# EAGLE design ATTEN_v2 (EAGLE 7.1.0)
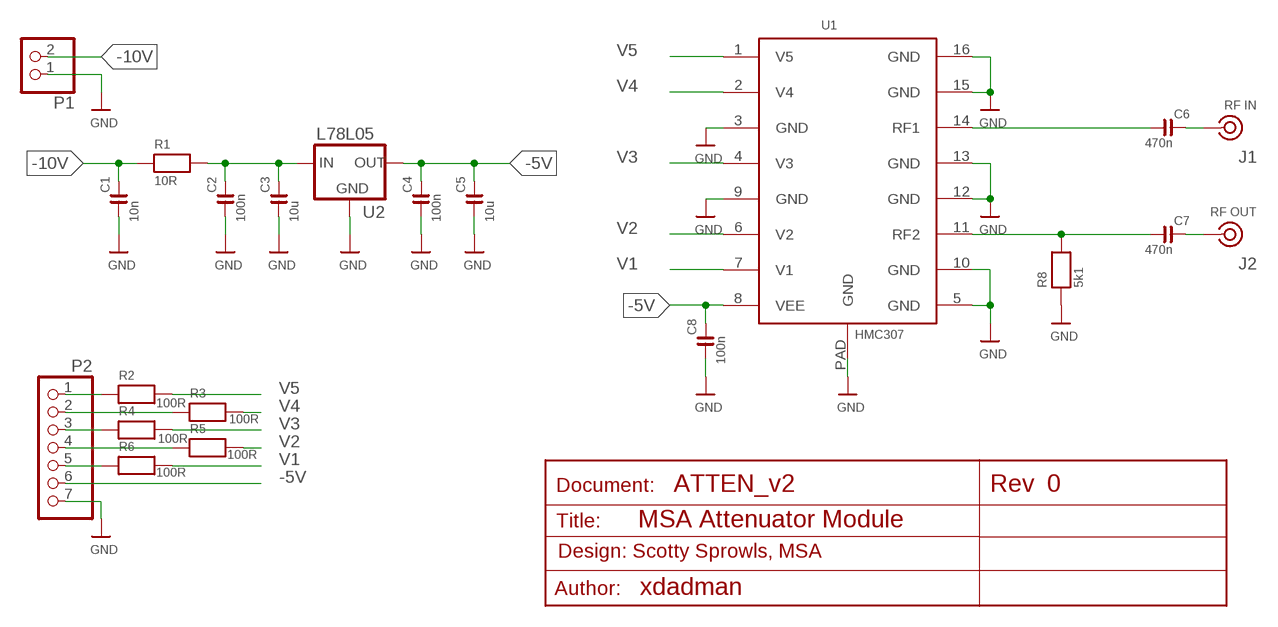
[diagram p0: schematic, sheet 1]

## Parts
C1  10n  C080510N  [C0805]
C2  100n  C0805100N  [C0805]
C3  10u  CC120610U  [1206]
C4  100n  C0805100N  [C0805]
C5  10u  CC120610U  [1206]
C6  470n  C0805470N  [C0805]
C7  470n  C0805470N  [C0805]
C8  100n  C0805100N  [C0805]
J1  RF IN  COAX  [SLIM_COAX_PAD]
J2  RF OUT  COAX  [SLIM_COAX_PAD]
P1  PINHD-1X2  [1X02]
P2  PINHD-1X7  [1X07]
R1  10R  R080510R  [R0805]
R2  100R  R0402100R  [R0402]
R3  100R  R0402100R  [R0402]
R4  100R  R0402100R  [R0402]
R5  100R  R0402100R  [R0402]
R6  100R  R0402100R  [R0402]
R8  5k1  R04025K1  [R0402]
U1  HMC307  [QSOP16_PAD]
U2  L78L05  [SOT89]

## Nets
-5V: C4.2 C5.2 C8.2 P2.6 U1.8(VEE) U2.3(OUT)
-10V: C1.2 P1.2 R1.1
GND: C1.1 C2.1 C3.1 C4.1 C5.1 C8.1 P1.1 P2.7 R8.1 U1.3(GND) U1.5(GND) U1.9(GND) U1.10(GND) U1.12(GND) U1.13(GND) U1.15(GND) U1.16(GND) U1.PAD(GND) U2.1(GND)
INV1: P2.5 R6.1
INV2: P2.4 R5.1
INV3: P2.3 R4.1
INV4: P2.2 R3.1
INV5: P2.1 R2.1
N$1: C2.2 C3.2 R1.2 U2.2(IN) U2.4(IN)
N$2 [50ohm_atten]: C6.2 J1.SIG
N$3 [50ohm_atten]: C7.2 J2.SIG
N$8 [50ohm_atten]: C7.1 R8.2 U1.11(RF2)
N$9 [50ohm_atten]: C6.1 U1.14(RF1)
V1: R6.2 U1.7(V1)
V2: R5.2 U1.6(V2)
V3: R4.2 U1.4(V3)
V4: R3.2 U1.2(V4)
V5: R2.2 U1.1(V5)

## Notes on the sheet
- 0
- MSA Attenuator Module
- Design: Scotty Sprowls, MSA
- xdadman

## Power pins joined to a net without a drawn wire
GND: J1.GND J2.GND

## Library data of the parts
C1 = MSA_lib:C0805: Ceramic capacitor; OC_FARNELL: 1414662
C2 C4 C8 = MSA_lib:C0805: Ceramic capacitor; OC_FARNELL: 1759166
C3 C5 = MSA_lib:CC1206: Capacitor ceramic 1206; OC_FARNELL: 1611967
C6 C7 = MSA_lib:C0805: Ceramic capacitor; OC_FARNELL: 1828926
J1 J2 = MSA_lib:COAX
P1 = MSA_lib:PINHD-1X2: PIN HEADER
P2 = MSA_lib:PINHD-1X7: PIN HEADER
R1 = MSA_lib:R0805: Resistors; OC_FARNELL: 2332043
R2-R6 = MSA_lib:R0402: R0402 resistor; OC_FARNELL: 2331443
R8 = MSA_lib:R0402: R0402 resistor; OC_FARNELL: 2331547
U1 = MSA_lib:HMC307: HMC307 Attenuator; OC_DIGIKEY: 1127-1327-1-ND
U2 = MSA_lib:L78L05: 7805 -5V LDO from STM; OC_FARNELL: 1366573

## Net classes
1 50ohm_atten: clearance 0.26 mm

## Board

Size 32 x 32 mm. Coordinates in mm from the lower left corner, seen from the top.
Outline: 0,0 32,0 32,32 0,32 0,0
Copper layers (1*16): Top 0.035mm / dielectric 1.5mm / Bottom 0.035mm
Design rules "kuba_no_CLR": minimum track width 8mil, minimum drill 15mil, track to track 8mil, track to pad 8mil, pad to pad 8mil, via to via 8mil, smd to smd 8mil, copper to edge 0mil, drill to drill 8mil, minimum pad ring 12mil, minimum via ring 10mil, stop-mask expansion 4mil, vias tented up to drill 0mil, thermal gap 10mil

### Footprints (pad centres in the part's own frame; a part is rotated, then mirrored left to right if it is on the bottom)
C0805 = smd 1.2 x 1.5: 1 -0.953,0; 2 0.953,0
1206 = smd 1.6 x 1.8: 1 -1.4,0; 2 1.4,0
SLIM_COAX_PAD = smd 1.27 x 0.635 bottom: GND 0,-2.667 | drill 1.1: SIG 0,0
1X02 = drill 1.016: 1 -1.27,0; 2 1.27,0
1X07 = drill 1.016: 1 -7.62,0; 2 -5.08,0; 3 -2.54,0; 4 0,0; 5 2.54,0; 6 5.08,0; 7 7.62,0
R0805 = smd 1.3 x 1.5: 1 -0.95,0; 2 0.95,0
R0402 = smd 0.6 x 0.6: 1 -0.5,0; 2 0.5,0
QSOP16_PAD = smd 1.6 x 0.356: 1 -2.667,2.235; 2 -2.667,1.575; 3 -2.667,0.965; 4 -2.667,0.305; 5 -2.667,-0.305; 6 -2.667,-0.965; 7 -2.667,-1.575; 8 -2.667,-2.235; 9 2.667,-2.235; 10 2.667,-1.6; 11 2.667,-0.965; 12 2.667,-0.305; 13 2.667,0.305; 14 2.667,0.965; 15 2.667,1.6; 16 2.667,2.235 | smd 1.8 x 2.4: PAD 0,0
SOT89 = smd 1.2 x 1.5: 1 -1.6,-2; 3 1.6,-2 | smd 1 x 1.5: 2 0,-2 | smd 2.4 x 3: 4 0,1.25

### Placement (x,y rotation side)
C1  7.4,4.32 90 top
C2  13.46,4.32 90 top
C3  11.43,5.08 90 top
C4  20.57,4.32 90 top
C5  22.1,7.37 180 top
C6  9.14,24.13 180 top
C7  22.86,24.13 0 top
C8  19.81,14.73 90 top
J1  7.11,24.13 270 top
J2  24.89,24.13 90 top
P1  4.79,5.32 90 top
P2  12.45,10.16 0 top
R1  8.38,7.11 0 top
R2  4.83,12.45 90 top
R3  7.37,12.45 90 top
R4  9.91,12.45 90 top
R5  12.45,12.45 90 top
R6  14.99,12.45 90 top
R8  20.83,23.37 90 top
U1  16.26,18.54 90 top
U2  16.51,6.1 90 top

### Tracks (layer width: path | path; a pad name or v marks a point on that pad's centre or on a via)
-5V
  Top 0.254: U1.8 18.49,13.92 17.53,12.95 P2.6
  Top 0.305: C8.2 18.68,15.68 U1.8
  Top 0.813: C4.2 20.57,5.38 | 18.29,8.38 18.51,8.38 U2.3 20.7,7.7 C5.2
  Top 1.016: 20.57,5.38 20.57,7.24 C5.2 | P2.6 17.53,9.14 18.29,8.38
-10V
  Top 0.813: P1.2 5.06,6.59 5.59,7.11 R1.1 7.43,5.3 C1.2
GND  (via drill 0.4)
  Top 0.254: U1.5 16.56,18.24 U1.PAD | U1.3 15.29,18.09 15.75,18.54
  other vias: 16.26,20.83 10.63,25.64 14.17,25.51 15.05,25.51 15.67,24.93 16.26,24.38 12.33,22.64 13.08,22.67 13.88,22.7 14.32,22.16 16.8,24.89 17.35,25.34 18.09,25.56 18.97,25.56 19.81,25.56 16.23,22.41 13.29,25.51 12.4,25.51 11.51,25.51 20.61,25.52 9.87,25.64 9.11,25.64 8.6,26.27 7.84,26.65 11.52,22.08 6.19,26.52 5.43,26.02 4.92,25.38 4.67,24.62 4.54,23.86 4.79,23.1 5.17,22.46 10.76,22.08 10.25,22.59 9.49,22.59 8.73,22.33 8.09,21.83 7.21,21.57 6.32,21.7 5.68,22.08 6.95,26.65 18.13,22.21 13.56,21.9 12.67,21.78 11.91,21.27 11.02,21.27 10.13,21.4 9.37,21.65 8.61,21.14 7.85,20.89 6.96,20.76 6.07,20.89 5.43,21.27 4.8,21.78 4.29,22.41 3.91,23.05 3.78,23.81 3.91,24.57 4.04,25.33 4.42,25.97 4.93,26.73 5.56,27.11 6.45,27.36 7.34,27.36 8.23,27.36 8.99,27.11 9.5,26.35 10.26,26.48 11.15,26.35 11.91,26.22 12.8,26.22 13.69,26.22 14.58,26.22 15.47,26.22 15.97,25.71 16.86,25.84 16.36,26.6 17.5,26.22 18.39,26.35 19.28,26.35 20.17,26.35 21.37,25.65 22.14,25.65 22.9,25.65 23.41,26.29 24.17,26.54 24.93,26.67 25.69,26.41 26.45,26.03 26.96,25.4 27.34,24.64 27.34,23.87 27.09,22.98 26.45,22.35 25.69,21.84 24.8,21.59 23.91,21.84 23.28,22.35 22.39,22.6 19.98,22.73 19.34,22.73 18.58,22.73 20.61,22.22 21.5,22.35 19.02,21.83 19.78,21.83 20.54,21.32 21.18,21.57 22.19,21.83 22.95,21.57 23.59,21.06 24.22,20.94 24.98,20.81 25.62,21.06 26.51,21.45 27.27,22.08 27.78,22.71 28.03,23.48 28.03,24.37 27.91,25.25 27.4,26.02 26.89,26.65 26.13,27.03 25.24,27.29 20.92,26.4 21.81,26.4 22.45,26.4 22.95,27.03 23.71,27.16 24.35,27.41 13.31,21.02 13.05,20.13 13.05,19.24 13.05,18.35 13.05,17.33 13.05,16.32 12.16,16.32 11.28,16.32 10.39,16.32 9.62,16.32 12.16,17.2 12.42,20.89 12.29,19.62 12.29,18.73 12.29,17.84 11.78,20.38 8.86,16.32 8.1,16.32 7.34,16.32 6.58,16.32 5.82,16.19 5.31,15.68 4.8,15.05 4.29,14.54 3.78,13.9 3.53,13.14 3.53,12.25 19.27,20.81 19.52,19.79 14.44,19.79 15.33,17.38 16.6,17.38 18,19.79 15.71,18.78 16.73,18.78 18,17.51 19.52,18.78 19.52,17.76 19.52,17 20.29,17 20.03,20.56 20.29,19.29 20.29,18.27 20.92,17.64 21.43,16.62 21.43,15.6 21.43,14.59 21.43,13.57 18.64,12.05 19.65,12.05 20.67,12.05 21.68,11.54 16.35,12.05 13.68,12.43 11.14,12.55 8.6,12.55 6.06,12.05 6.7,14.33 2.77,10.22 2.26,8.95 4.54,18.6 8.76,8.64 11.15,8.44 13.69,8.44 26.39,9.2 24.86,2.35 18.77,3.49 27.91,9.2 22.2,5.65 22.07,9.2 23.34,9.2 24.86,9.2 24.86,7.43 24.86,5.65 23.34,5.65 2.77,4.12 4.8,2.09 6.32,2.35 7.59,2.6 8.86,2.35 9.37,5.39 10.13,2.09 11.4,2.09 12.67,2.09 14.2,2.09 15.72,2.09 17.5,2.09 19.02,2.09 28.68,3.62 20.55,2.47 22.2,3.62 2.77,5.65 2.77,7.17 0.99,0.82 4.29,0.82 9.12,0.82 13.18,0.82 17.25,0.82 21.56,0.82 26.64,0.82 31.21,0.82 31.47,5.39 31.21,9.71 31.21,14.54 31.21,19.11 31.21,23.68 30.96,31.05 30.96,27.24 27.41,31.05 22.83,31.05 17.5,31.05 12.93,31.05 8.1,31.05 0.99,31.05 4.54,31.05 0.99,27.75 0.99,23.94 0.99,19.62 0.99,15.55 0.99,11.24 0.99,7.43 0.99,3.87 3.27,2.6 29.69,9.2
  pour Top (no thermals): 0,0 32,0 32,32 0,32
  pour Bottom: 0,0 32,0 32,32 0,32
INV1
  Top 0.406: R6.1 P2.5
INV2
  Top 0.406: R5.1 P2.4
INV3
  Top 0.406: R4.1 P2.3
INV4
  Top 0.406: R3.1 P2.2
INV5
  Top 0.406: R2.1 P2.1
N$1
  Top 0.813: R1.2 10.8,7.11 C3.2 12.06,6.48 12.95,5.59 13.14,5.59 C2.2 13.46,5.38 15.26,5.38 | U2.2 U2.4 15.26,5.38 | 15.26,5.38 16.76,5.38
N$2
  Top 1: J1.SIG C6.2
N$3
  Top 1: J2.SIG C7.2
N$8
  Top 0.305: U1.11 17.22,23.32 | R8.2 21.07,23.87 21.34,24.13
  Top 1.2: 17.22,23.32 18.03,24.13 21.34,24.13 C7.1
N$9
  Top 0.305: U1.14 15.29,23.32 14.86,23.75 | 10.93,23.87 10.67,24.13
  Top 1.2: 15.24,23.37 14.86,23.75 14.48,24.13 10.67,24.13 C6.1
V1
  Top 0.254: U1.7 17.83,14.02 17.02,13.21 15.25,13.21 R6.2
V2
  Top 0.254: U1.6 17.22,14.17 16.76,13.72 12.7,13.72 12.45,13.46 R5.2
V3
  Top 0.254: U1.4 15.95,14.68 15.49,14.22 10.16,14.22 9.91,13.97 R4.2
V4
  Top 0.254: U1.2 14.68,14.94 14.48,14.73 8.38,14.73 7.37,13.72 R3.2
V5
  Top 0.254: U1.1 14.02,15.29 13.97,15.24 6.35,15.24 4.83,13.72 R2.2

### Text on the board
tPlace: J1-INPUT | J2-OUTPUT | C6 | C7 | R7 | R8 | U1 | R3 | R4 | R5 | R6 | R2 | C8 | Attenuator | P2 | 54321-5VG | -10V | R1 | C3 | C5 | C2 | P1 | C4 | C1 | U2